# Altium project Forehead Module.PrjPcb
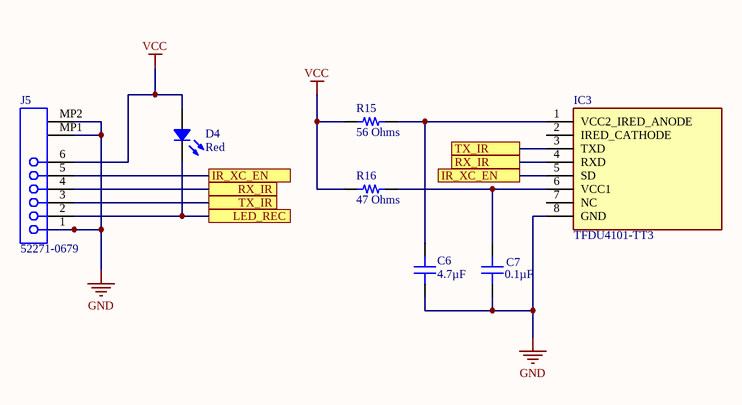
[diagram p0: Forehead Module.SchDoc]
1 sheet, 7 parts. Net scope: flat (ports and power ports of the same name join across sheets).
Board file: Forehead Module.PcbDoc

## Sheet Forehead Module.SchDoc
size A

### Parts
C6  4.7µF  [CAP 1210_3225 - 2.8MM]
C7  0.1µF  [CAP 0603_1608]
D4  Red  [LED 1206_3216 RED]
IC3  TFDU4101-TT3  [TFDU4101-TR3]
J5  52271-0679  [MOLX-52271-0679]
R15  56 Ohms  [RES 0603_1608]
R16  47 Ohms  [RES 0603_1608]

### Ports
IR_XC_EN, LED_REC, RX_IR, TX_IR

### Nets
GND: C6.1 C7.1 IC3.8(GND) J5.1 J5.MP1 J5.MP2
VCC: D4.1 J5.6 R15.1 R16.1
IR_XC_EN: IC3.5(SD) J5.5 ; port IR_XC_EN
LED_REC: D4.2 J5.2 ; port LED_REC
RX_IR: IC3.4(RXD) J5.4 ; port RX_IR
TX_IR: IC3.3(TXD) J5.3 ; port TX_IR
NetC6_2: C6.2 IC3.1(VCC2_IRED_ANODE) R15.2
NetC7_2: C7.2 IC3.6(VCC1) R16.2

Not connected (* = marked no-connect by the designer): IC3 2(IRED_CATHODE) 7(NC)

### Library data of the parts
C6 = UMK325B7475KM-T: CAP CER 4.7UF 50V X7R 1210; Manufacturer: Taiyo Yuden; Tolerance: ±10%; Part Number: UMK325B7475KM-T; Value: 4.7µF; Applications: General Purpose; Capacitance: 4.7µF; ComponentLink1Description: Datasheet; ComponentLink1URL: https://www.yuden.co.jp/productdata/catalog/mlcc01_e.pdf; ComponentLink2Description: DigiKey Link; ComponentLink2URL: http://digikey.com/product-detail/en/taiyo-yuden/UMK325B7475KM-T/587-2673-1-ND/2417260; Device Package: 1210 (3225 Metric); LastUpdated: 1/21/2020 12:30:50 AM; Lifecycle Status: Active; Minimum Order: 1; Mounting Type: Surface Mount, MLCC; Operating Temperature: -55°C ~ 125°C; Package / Case: 1210 (3225 Metric); Packaging: TapeAndReel; PartId: 23636; Part Status: Active; Price: 0.16; Series: M; Size / Dimension: 0.126" L x 0.098" W (3.20mm x 2.50mm); Supplier 1: DigiKey; Supplier Part Number 1: 587-2673-1-ND; Temperature Coefficient: X7R; Thickness (Max): 0.106" (2.70mm); Voltage - Rated: 50V
C7 = C0603C104K5RAC7411: CAP CER 0.1UF 50V X7R 0603; Manufacturer: KEMET; Tolerance: ±10%; Part Number: C0603C104K5RAC7411; Value: 0.1µF; Applications: Bypass, Decoupling; Capacitance: 0.1µF; ComponentLink1Description: Datasheet; ComponentLink1URL: https://api.kemet.com/component-edge/download/datasheet/C0603C104K5RAC7411.pdf; ComponentLink2Description: DigiKey Link; ComponentLink2URL: http://digikey.com/product-detail/en/kemet/C0603C104K5RAC7411/399-7374-2-ND/3317013; Device Package: 0603 (1608 Metric); LastUpdated: 1/21/2020 12:02:09 AM; Lifecycle Status: Active; Minimum Order: 15000; Mounting Type: Surface Mount, MLCC; Operating Temperature: -55°C ~ 125°C; Package / Case: 0603 (1608 Metric); Packaging: TapeAndReel; PartId: 2233; Part Status: Active; Price: 0.02; Series: SMD Comm X7R; Size / Dimension: 0.063" L x 0.031" W (1.60mm x 0.80mm); Supplier 1: DigiKey; Supplier Part Number 1: 399-7374-2-ND; Temperature Coefficient: X7R; Thickness (Max): 0.035" (0.90mm); Voltage - Rated: 50V
D4 = SML-LX1206IW-TR: LED RED DIFFUSED 1206 SMD; Manufacturer: Lumex Opto/Components Inc.; Configuration: Standard; Current - Test: 20mA; Lens Color: White; Lens Size: 2.00mm x 1.60mm; Lens Style: Rectangle with Flat Top; Millicandela Rating: 6mcd; Viewing Angle: 160°; Voltage - Forward (Vf) (Typ): 2V; Wavelength - Peak: 635nm; Part Number: SML-LX1206IW-TR; Color: Red; ComponentLink1Description: Datasheet; ComponentLink1URL: https://www.lumex.com/content/files/ProductAttachment/SML-LX1206IW-TR.pdf; ComponentLink2Description: DigiKey Link; ComponentLink2URL: http://digikey.com/product-detail/en/lumex-opto-components-inc/SML-LX1206IW-TR/67-1003-1-ND/270801; Device Package: 1206 (3216 Metric); Height (Max): 1.10mm; LastUpdated: 1/21/2020 3:14:28 AM; Lens Transparency: Diffused; Lifecycle Status: Active; Minimum Order: 1; Mounting Type: Surface Mount; Package / Case: 1206 (3216 Metric); Packaging: TapeAndReel; PartId: 192; Part Status: Active; Price: 0.08; Series: -; Size / Dimension: 3.20mm L x 1.60mm W; Supplier 1: DigiKey; Supplier Part Number 1: 67-1003-1-ND; Supplier Device Package: 1206; Value: Red
IC3 = TFDU4101-TT3: Integrated Circuit; Manufacturer_Name: Vishay; Datasheet Link: https://www.vishay.com/docs/81288/tfdu4101.pdf; Manufacturer_Part_Number: TFDU4101-TT3; Arrow Part Number: TFDU4101-TT3; Arrow Price/Stock: https://www.arrow.com/en/products/tfdu4101-tt3/vishay; Mouser Part Number: 782-TFDU4101-TT3; Mouser Price/Stock: https://www.mouser.com/Search/Refine.aspx?Keyword=782-TFDU4101-TT3
J5 = 52271-0679: 1.0 mm Pitch Easy-On(TM) Type FPC Connector, 3.0 mm Mated Height, Right Angle, ZIF, SMT, Bottom Contact, 6 Circuits, -40 to 85 degC, ELV and RoHS Compliant, Tape and Reel; Manufacturer: Molex; Circuits (Loaded): 6; Current (Max per Contact): 0.5A; Durability (mating cycles max): 30; Entry Angle: 90degrees Angle; Mated Height: 3.00mm; Material - Metal: Phosphor Bronze; Material - Plating Mating: Tin-Bismuth; PCB Locator: No; PCB Retention: Yes; Pitch - Mating Interface: 1.00mm; Voltage (Max): 50V AC (RMS)/DC; PackageVersion: Rev. B, 04/2004; PackageReference: 52271-0679; PackageDescription: 6-Lead FPC Connector, Pitch 1.0 mm; Supplier 1: Farnell; Supplier Part Number 1: 1079950; Supplier 2: Newark; Supplier Part Number 2: 58J9529; Supplier 3: Mouser; Supplier Part Number 3: 538-52271-0679; Contact Position: Bottom; Material - Plating Termination: Tin-Bismuth; Number of Rows: 1; Orientation: Right Angle; Packing: Tape and Reel; Pitch - Termination Interface: 1.00mm; Polarized to PCB: Yes; RoHS: TRUE; Stackable: No; Mounting Technology: Surface Mount; PartNumber: 52271-0679; ComponentLink1Description: Manufacturer URL; ComponentLink1URL: http://www.molex.com/molex/index.jsp; ComponentLink2Description: Datasheet; ComponentLink2URL: http://www.molex.com/webdocs/datasheets/pdf/en-us/0522710679_FFC_FPC_CONNECTORS.pdf; ComponentLink3Description: Package Specification; ComponentLink3URL: http://www.molex.com/pdm_docs/sd/522710679_sd.pdf; System: Connector
R15 = ERJ-PA3F56R0V: RES SMD 56 OHM 1% 1/4W 0603; Manufacturer: Panasonic Electronic Components; Power (Watts): 0.25W, 1/4W; Temperature Coefficient: ±100ppm/°C; Part Number: ERJ-PA3F56R0V; Value: 56 Ohms; ComponentLink1Description: Datasheet; ComponentLink1URL: https://industrial.panasonic.com/cdbs/www-data/pdf/RDO0000/AOA0000C331.pdf; ComponentLink2Description: DigiKey Link; ComponentLink2URL: http://digikey.com/product-detail/en/panasonic-electronic-components/ERJ-PA3F56R0V/P56.00BYCT-ND/5036208; Composition: Thick Film; Device Package: 0603 (1608 Metric); Features: Automotive AEC-Q200, Pulse Withstanding; Height - Seated (Max): 0.022" (0.55mm); LastUpdated: 1/21/2020 12:20:58 AM; Lifecycle Status: Active; Minimum Order: 1; Number of Terminations: 2; Operating Temperature: -55°C ~ 155°C; Package / Case: 0603 (1608 Metric); Packaging: TapeAndReel; PartId: 14708; Part Status: Active; Price: 0.02; Ratings: AEC-Q200; Resistance: 56 Ohms; Series: ERJ; Size / Dimension: 0.063" L x 0.031" W (1.60mm x 0.80mm); Supplier 1: DigiKey; Supplier Part Number 1: P56.00BYCT-ND; Supplier Device Package: 0603; Tolerance: ±1%
R16 = RCS060347R0FKEA: RES SMD 47 OHM 1% 1/4W 0603; Manufacturer: Vishay Dale; Power (Watts): 0.25W, 1/4W; Temperature Coefficient: ±100ppm/°C; Part Number: RCS060347R0FKEA; Value: 47 Ohms; ComponentLink1Description: Datasheet; ComponentLink1URL: http://www.vishay.com/docs/20065/rcse3.pdf; ComponentLink2Description: DigiKey Link; ComponentLink2URL: http://digikey.com/product-detail/en/vishay-dale/RCS060347R0FKEA/541-10470-1-ND/10059836; Composition: Thick Film; Device Package: 0603 (1608 Metric); Features: Automotive AEC-Q200, Pulse Withstanding; Height - Seated (Max): 0.020" (0.50mm); LastUpdated: 1/21/2020 12:15:03 AM; Lifecycle Status: Active; Minimum Order: 1; Number of Terminations: 2; Operating Temperature: -55°C ~ 155°C; Package / Case: 0603 (1608 Metric); Packaging: TapeAndReel; PartId: 25618; Part Status: Active; Price: 0.02; Ratings: AEC-Q200; Resistance: 47 Ohms; Series: AccliMate™ RCU; Size / Dimension: 0.061" L x 0.033" W (1.55mm x 0.85mm); Supplier 1: DigiKey; Supplier Part Number 1: 541-10470-1-ND; Supplier Device Package: 0603; Tolerance: ±1%